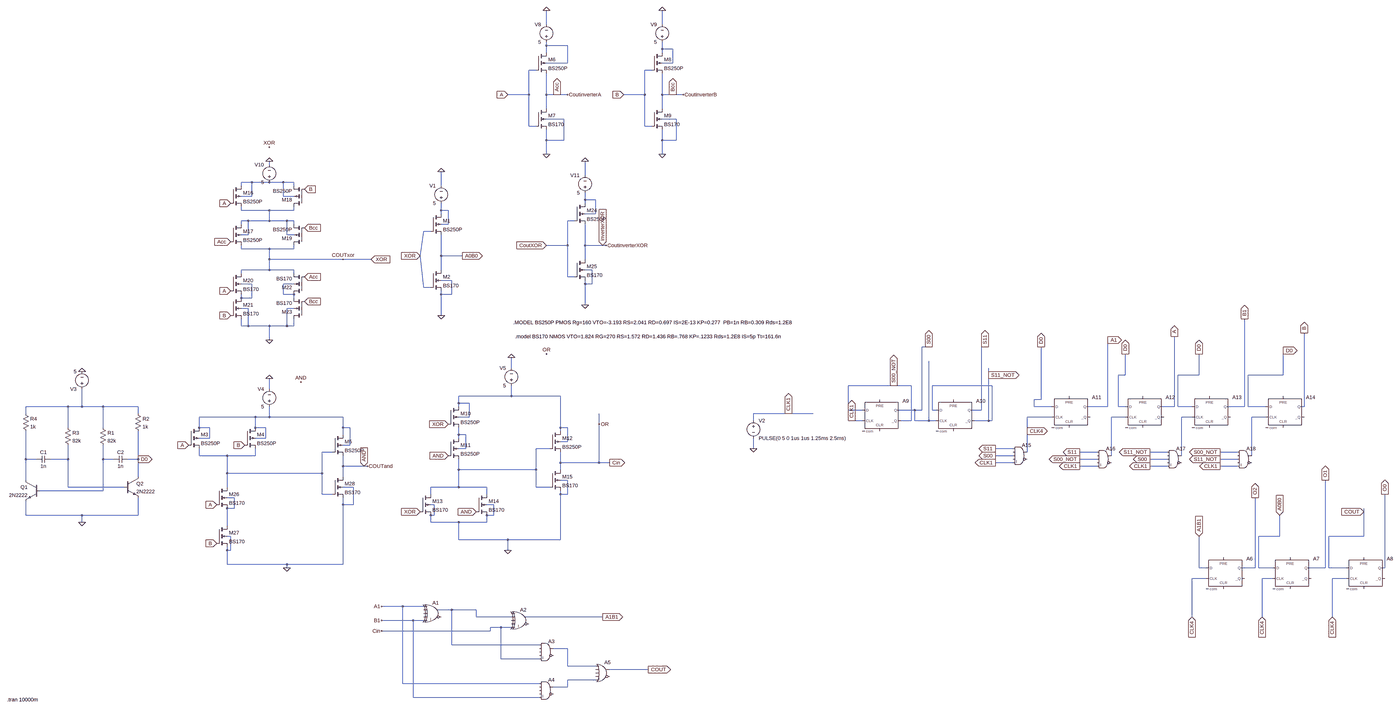
[diagram p0: schematic TASK_4.asc, whole sheet]
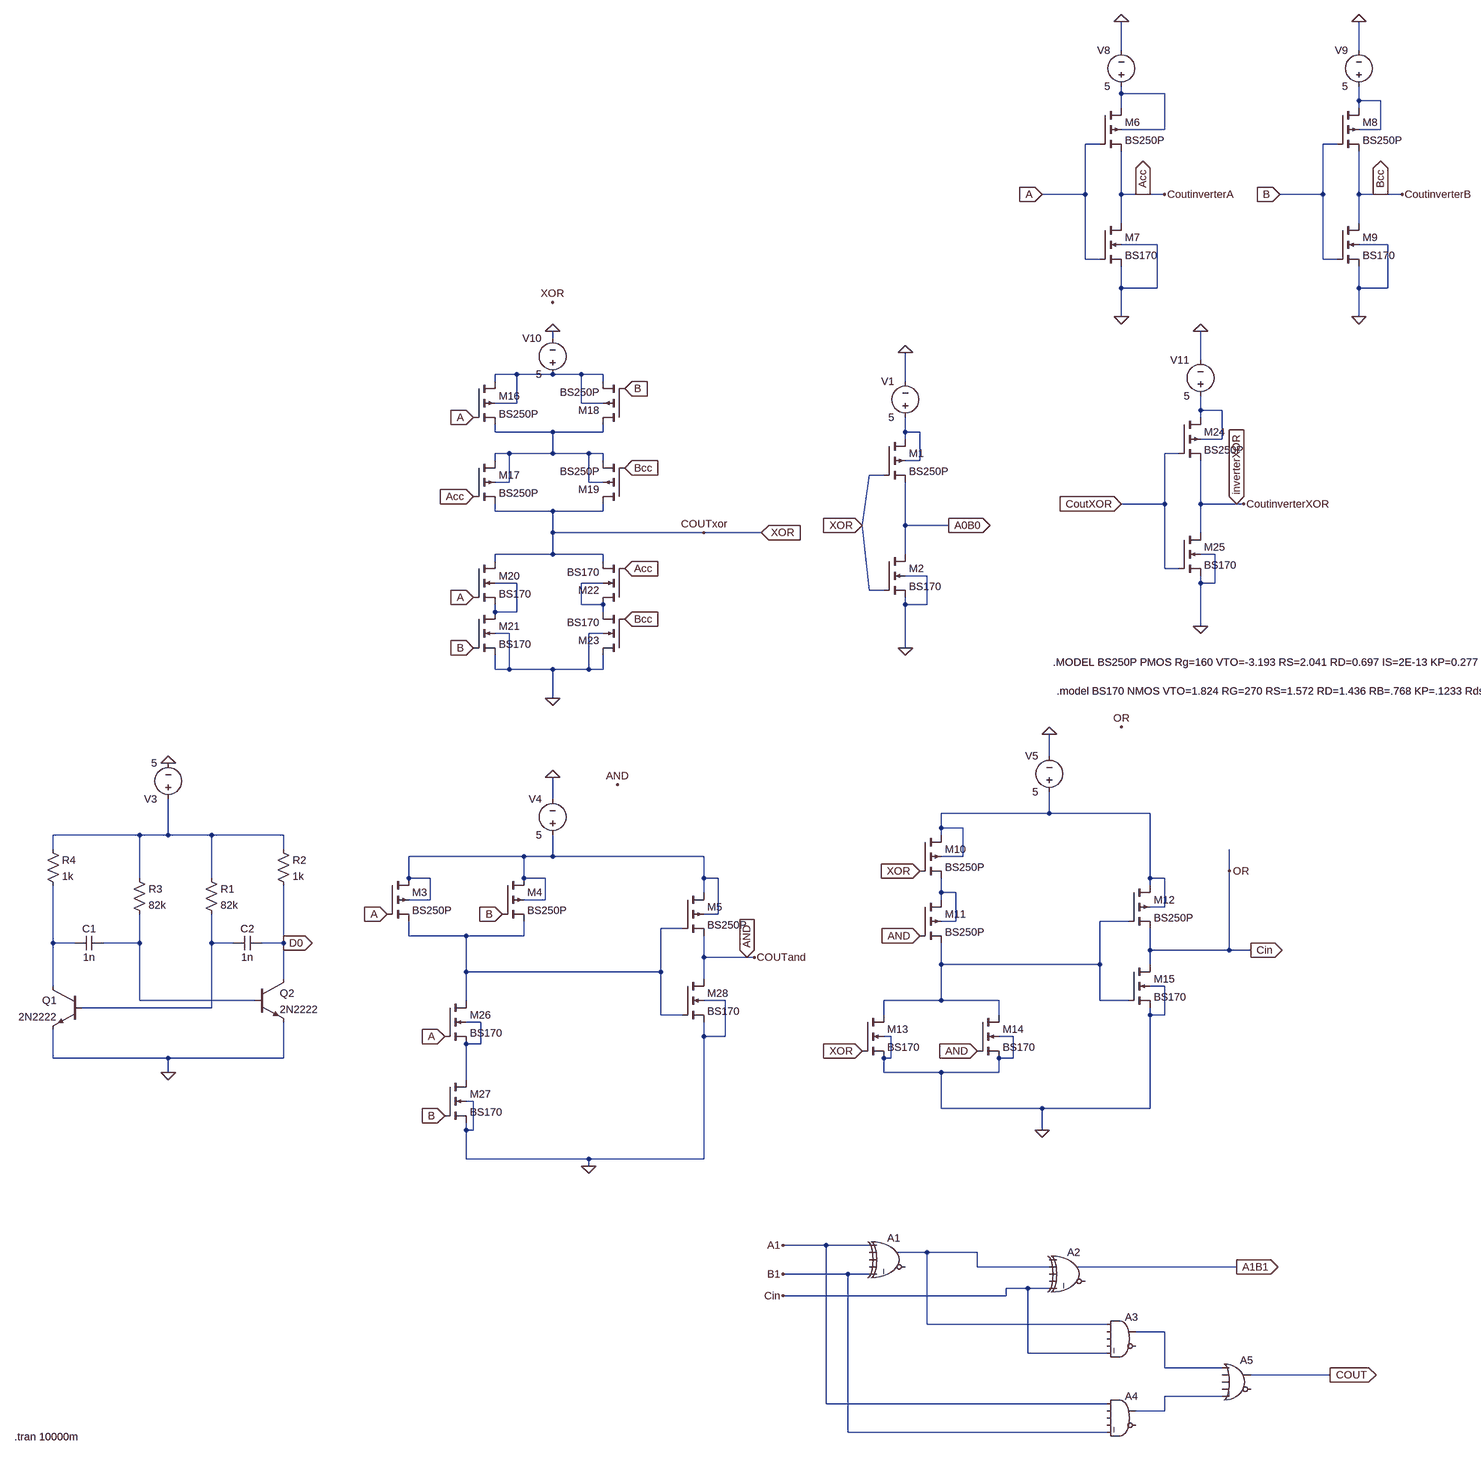
[diagram p1: schematic TASK_4.asc, part, row 1 of 1, column 1 of 2]
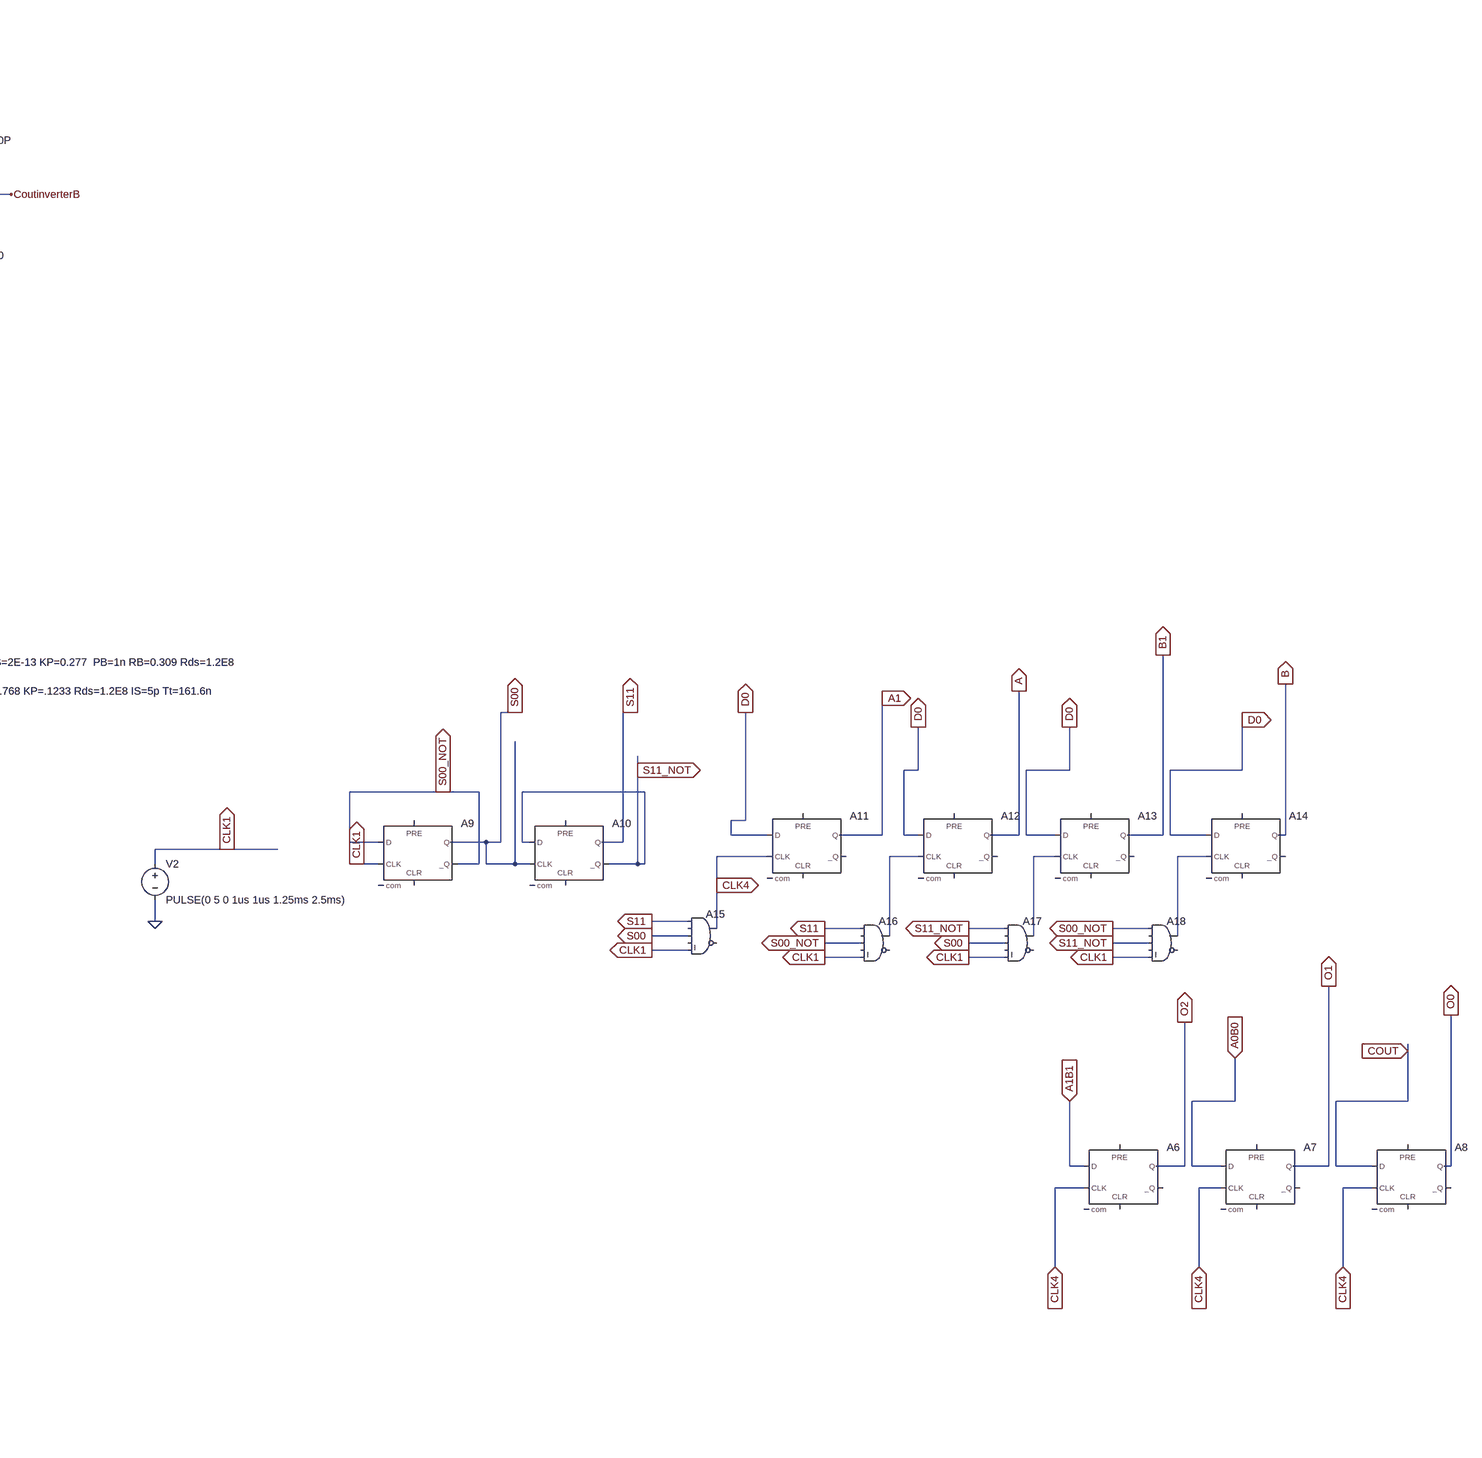
[diagram p2: schematic TASK_4.asc, part, row 1 of 1, column 2 of 2]
TASK_4.asc, the LTspice schematic file:
Version 4
SHEET 1 880 680
WIRE -4480 -4096 -4480 -4160
WIRE -3952 -4096 -3952 -4160
WIRE -4480 -4000 -4480 -4016
WIRE -4384 -4000 -4480 -4000
WIRE -3952 -3984 -3952 -4016
WIRE -3904 -3984 -3952 -3984
WIRE -4480 -3968 -4480 -4000
WIRE -3952 -3968 -3952 -3984
WIRE -4384 -3920 -4384 -4000
WIRE -4384 -3920 -4480 -3920
WIRE -3904 -3920 -3904 -3984
WIRE -3904 -3920 -3952 -3920
WIRE -4528 -3888 -4560 -3888
WIRE -4000 -3888 -4032 -3888
WIRE -4560 -3776 -4560 -3888
WIRE -4560 -3776 -4656 -3776
WIRE -4480 -3776 -4480 -3872
WIRE -4432 -3776 -4480 -3776
WIRE -4384 -3776 -4432 -3776
WIRE -4032 -3776 -4032 -3888
WIRE -4032 -3776 -4128 -3776
WIRE -3952 -3776 -3952 -3872
WIRE -3904 -3776 -3952 -3776
WIRE -3856 -3776 -3904 -3776
WIRE -4480 -3712 -4480 -3776
WIRE -3952 -3712 -3952 -3776
WIRE -4400 -3664 -4480 -3664
WIRE -3888 -3664 -3952 -3664
WIRE -4560 -3632 -4560 -3776
WIRE -4528 -3632 -4560 -3632
WIRE -4032 -3632 -4032 -3776
WIRE -4000 -3632 -4032 -3632
WIRE -4480 -3568 -4480 -3616
WIRE -4400 -3568 -4400 -3664
WIRE -4400 -3568 -4480 -3568
WIRE -3952 -3568 -3952 -3616
WIRE -3888 -3568 -3888 -3664
WIRE -3888 -3568 -3952 -3568
WIRE -4480 -3504 -4480 -3568
WIRE -3952 -3504 -3952 -3568
WIRE -5744 -3456 -5744 -3472
WIRE -4304 -3408 -4304 -3472
WIRE -5824 -3376 -5872 -3376
WIRE -5744 -3376 -5824 -3376
WIRE -5680 -3376 -5744 -3376
WIRE -5632 -3376 -5680 -3376
WIRE -5872 -3360 -5872 -3376
WIRE -5632 -3360 -5632 -3376
WIRE -4960 -3360 -4960 -3424
WIRE -5824 -3312 -5824 -3376
WIRE -5824 -3312 -5872 -3312
WIRE -5680 -3312 -5680 -3376
WIRE -5632 -3312 -5680 -3312
WIRE -4304 -3296 -4304 -3328
WIRE -4256 -3296 -4304 -3296
WIRE -4304 -3280 -4304 -3296
WIRE -5872 -3248 -5872 -3264
WIRE -5744 -3248 -5872 -3248
WIRE -5632 -3248 -5632 -3264
WIRE -5632 -3248 -5744 -3248
WIRE -4960 -3248 -4960 -3280
WIRE -4928 -3248 -4960 -3248
WIRE -4960 -3232 -4960 -3248
WIRE -4256 -3232 -4256 -3296
WIRE -4256 -3232 -4304 -3232
WIRE -5840 -3200 -5872 -3200
WIRE -5744 -3200 -5744 -3248
WIRE -5744 -3200 -5840 -3200
WIRE -5664 -3200 -5744 -3200
WIRE -5632 -3200 -5664 -3200
WIRE -4352 -3200 -4384 -3200
WIRE -5872 -3184 -5872 -3200
WIRE -5632 -3184 -5632 -3200
WIRE -4928 -3184 -4928 -3248
WIRE -4928 -3184 -4960 -3184
WIRE -5008 -3152 -5040 -3152
WIRE -5840 -3136 -5840 -3200
WIRE -5840 -3136 -5872 -3136
WIRE -5664 -3136 -5664 -3200
WIRE -5632 -3136 -5664 -3136
WIRE -4384 -3088 -4384 -3200
WIRE -4384 -3088 -4480 -3088
WIRE -4304 -3088 -4304 -3184
WIRE -4224 -3088 -4304 -3088
WIRE -4208 -3088 -4224 -3088
WIRE -5872 -3072 -5872 -3088
WIRE -5744 -3072 -5872 -3072
WIRE -5632 -3072 -5632 -3088
WIRE -5632 -3072 -5744 -3072
WIRE -5056 -3040 -5040 -3152
WIRE -4960 -3040 -4960 -3136
WIRE -4864 -3040 -4960 -3040
WIRE -5744 -3024 -5744 -3072
WIRE -5408 -3024 -5744 -3024
WIRE -5280 -3024 -5408 -3024
WIRE -4304 -3024 -4304 -3088
WIRE -5744 -2976 -5744 -3024
WIRE -5744 -2976 -5872 -2976
WIRE -5632 -2976 -5744 -2976
WIRE -4960 -2976 -4960 -3040
WIRE -4272 -2976 -4304 -2976
WIRE -5872 -2960 -5872 -2976
WIRE -5632 -2960 -5632 -2976
WIRE -4384 -2944 -4384 -3088
WIRE -4352 -2944 -4384 -2944
WIRE -4912 -2928 -4960 -2928
WIRE -5824 -2912 -5872 -2912
WIRE -5632 -2912 -5680 -2912
WIRE -4304 -2912 -4304 -2928
WIRE -4272 -2912 -4272 -2976
WIRE -4272 -2912 -4304 -2912
WIRE -5040 -2896 -5056 -3040
WIRE -5008 -2896 -5040 -2896
WIRE -5680 -2864 -5680 -2912
WIRE -5632 -2864 -5680 -2864
WIRE -4960 -2864 -4960 -2880
WIRE -4912 -2864 -4912 -2928
WIRE -4912 -2864 -4960 -2864
WIRE -5872 -2848 -5872 -2864
WIRE -5824 -2848 -5824 -2912
WIRE -5824 -2848 -5872 -2848
WIRE -5632 -2848 -5632 -2864
WIRE -4304 -2816 -4304 -2912
WIRE -5840 -2800 -5872 -2800
WIRE -5632 -2800 -5664 -2800
WIRE -4960 -2768 -4960 -2864
WIRE -5872 -2720 -5872 -2752
WIRE -5840 -2720 -5840 -2800
WIRE -5840 -2720 -5872 -2720
WIRE -5744 -2720 -5840 -2720
WIRE -5664 -2720 -5664 -2800
WIRE -5664 -2720 -5744 -2720
WIRE -5632 -2720 -5632 -2752
WIRE -5632 -2720 -5664 -2720
WIRE -5744 -2656 -5744 -2720
WIRE -1920 -2656 -1920 -2672
WIRE -2736 -2624 -2768 -2624
WIRE -2720 -2624 -2736 -2624
WIRE -2480 -2624 -2496 -2624
WIRE -2464 -2624 -2480 -2624
WIRE -1120 -2608 -1120 -2624
WIRE -4640 -2528 -4640 -2576
WIRE -2464 -2496 -2464 -2528
WIRE -1840 -2496 -1840 -2592
WIRE -1840 -2496 -1872 -2496
WIRE -1504 -2496 -1504 -2592
WIRE -1504 -2496 -1600 -2496
WIRE -1120 -2496 -1120 -2608
WIRE -1120 -2496 -1280 -2496
WIRE -2896 -2448 -3104 -2448
WIRE -2816 -2448 -2896 -2448
WIRE -2448 -2448 -2720 -2448
WIRE -5744 -2432 -5744 -2480
WIRE -4640 -2400 -4640 -2448
WIRE -4640 -2400 -4880 -2400
WIRE -4416 -2400 -4640 -2400
WIRE -2224 -2384 -2224 -2624
WIRE -2224 -2384 -2256 -2384
WIRE -4880 -2368 -4880 -2400
WIRE -4832 -2368 -4880 -2368
WIRE -6864 -2352 -7056 -2352
WIRE -6800 -2352 -6800 -2432
WIRE -6800 -2352 -6864 -2352
WIRE -6704 -2352 -6800 -2352
WIRE -6544 -2352 -6704 -2352
WIRE -4880 -2352 -4880 -2368
WIRE -2256 -2352 -2256 -2384
WIRE -2176 -2352 -2256 -2352
WIRE -1920 -2352 -1920 -2656
WIRE -1920 -2352 -2016 -2352
WIRE -1872 -2352 -1872 -2496
WIRE -1840 -2352 -1872 -2352
WIRE -1616 -2352 -1616 -2672
WIRE -1616 -2352 -1680 -2352
WIRE -1600 -2352 -1600 -2496
WIRE -1536 -2352 -1600 -2352
WIRE -1296 -2352 -1296 -2752
WIRE -1296 -2352 -1376 -2352
WIRE -1280 -2352 -1280 -2496
WIRE -1200 -2352 -1280 -2352
WIRE -1024 -2352 -1024 -2688
WIRE -1024 -2352 -1040 -2352
WIRE -3104 -2336 -3104 -2448
WIRE -3040 -2336 -3104 -2336
WIRE -2800 -2336 -2880 -2336
WIRE -2768 -2336 -2768 -2624
WIRE -2768 -2336 -2800 -2336
WIRE -2720 -2336 -2720 -2448
WIRE -2704 -2336 -2720 -2336
WIRE -2496 -2336 -2496 -2624
WIRE -2496 -2336 -2544 -2336
WIRE -7056 -2320 -7056 -2352
WIRE -6544 -2320 -6544 -2352
WIRE -3376 -2320 -3536 -2320
WIRE -3264 -2320 -3376 -2320
WIRE -5808 -2304 -6064 -2304
WIRE -5744 -2304 -5744 -2352
WIRE -5744 -2304 -5808 -2304
WIRE -5408 -2304 -5744 -2304
WIRE -4832 -2304 -4832 -2368
WIRE -4832 -2304 -4880 -2304
WIRE -2176 -2304 -2288 -2304
WIRE -1840 -2304 -1904 -2304
WIRE -1536 -2304 -1584 -2304
WIRE -1200 -2304 -1264 -2304
WIRE -3536 -2288 -3536 -2320
WIRE -3088 -2288 -3104 -2288
WIRE -3040 -2288 -3088 -2288
WIRE -2816 -2288 -2816 -2448
WIRE -2816 -2288 -2864 -2288
WIRE -2800 -2288 -2800 -2336
WIRE -2736 -2288 -2736 -2560
WIRE -2736 -2288 -2800 -2288
WIRE -2704 -2288 -2736 -2288
WIRE -2464 -2288 -2464 -2496
WIRE -2464 -2288 -2528 -2288
WIRE -2448 -2288 -2448 -2448
WIRE -2448 -2288 -2464 -2288
WIRE -4240 -2272 -4240 -2320
WIRE -6864 -2256 -6864 -2352
WIRE -6704 -2256 -6704 -2352
WIRE -6064 -2256 -6064 -2304
WIRE -6016 -2256 -6064 -2256
WIRE -5808 -2256 -5808 -2304
WIRE -5760 -2256 -5808 -2256
WIRE -5408 -2256 -5408 -2304
WIRE -5376 -2256 -5408 -2256
WIRE -4416 -2256 -4416 -2400
WIRE -4384 -2256 -4416 -2256
WIRE -4416 -2240 -4416 -2256
WIRE -2288 -2240 -2288 -2304
WIRE -5408 -2224 -5408 -2256
WIRE -4880 -2224 -4880 -2256
WIRE -4848 -2224 -4880 -2224
WIRE -6016 -2208 -6016 -2256
WIRE -6016 -2208 -6064 -2208
WIRE -5760 -2208 -5760 -2256
WIRE -5760 -2208 -5808 -2208
WIRE -4880 -2208 -4880 -2224
WIRE -4384 -2192 -4384 -2256
WIRE -4384 -2192 -4416 -2192
WIRE -5376 -2176 -5376 -2256
WIRE -5376 -2176 -5408 -2176
WIRE -4848 -2160 -4848 -2224
WIRE -4848 -2160 -4880 -2160
WIRE -4464 -2160 -4528 -2160
WIRE -3536 -2160 -3536 -2208
WIRE -2352 -2160 -2432 -2160
WIRE -5456 -2144 -5504 -2144
WIRE -2288 -2144 -2288 -2240
WIRE -1968 -2144 -2048 -2144
WIRE -1648 -2144 -1728 -2144
WIRE -1328 -2144 -1408 -2144
WIRE -6064 -2128 -6064 -2160
WIRE -5936 -2128 -6064 -2128
WIRE -5808 -2128 -5808 -2160
WIRE -5808 -2128 -5936 -2128
WIRE -2352 -2128 -2432 -2128
WIRE -1904 -2128 -1904 -2304
WIRE -1584 -2128 -1584 -2304
WIRE -1264 -2128 -1264 -2304
WIRE -7056 -2112 -7056 -2240
WIRE -7008 -2112 -7056 -2112
WIRE -6864 -2112 -6864 -2176
WIRE -6864 -2112 -6944 -2112
WIRE -6704 -2112 -6704 -2176
WIRE -6656 -2112 -6704 -2112
WIRE -6544 -2112 -6544 -2240
WIRE -6544 -2112 -6592 -2112
WIRE -1968 -2112 -2048 -2112
WIRE -1648 -2112 -1728 -2112
WIRE -1328 -2112 -1408 -2112
WIRE -4416 -2096 -4416 -2144
WIRE -4240 -2096 -4240 -2272
WIRE -4240 -2096 -4416 -2096
WIRE -4192 -2096 -4240 -2096
WIRE -2352 -2096 -2432 -2096
WIRE -5408 -2080 -5408 -2128
WIRE -5312 -2080 -5408 -2080
WIRE -5296 -2080 -5312 -2080
WIRE -1968 -2080 -2048 -2080
WIRE -1648 -2080 -1728 -2080
WIRE -1328 -2080 -1408 -2080
WIRE -4880 -2064 -4880 -2112
WIRE -4528 -2064 -4528 -2160
WIRE -4528 -2064 -4880 -2064
WIRE -4416 -2064 -4416 -2096
WIRE -5936 -2048 -5936 -2128
WIRE -5504 -2048 -5504 -2144
WIRE -5504 -2048 -5936 -2048
WIRE -6544 -2032 -6544 -2112
WIRE -5408 -2032 -5408 -2080
WIRE -7056 -2016 -7056 -2112
WIRE -4384 -2016 -4416 -2016
WIRE -6864 -1984 -6864 -2112
WIRE -6608 -1984 -6864 -1984
WIRE -5936 -1984 -5936 -2048
WIRE -5360 -1984 -5408 -1984
WIRE -4880 -1984 -4880 -2064
WIRE -4880 -1984 -5008 -1984
WIRE -4752 -1984 -4880 -1984
WIRE -4528 -1984 -4528 -2064
WIRE -4464 -1984 -4528 -1984
WIRE -6704 -1968 -6704 -2112
WIRE -6704 -1968 -6992 -1968
WIRE -5504 -1952 -5504 -2048
WIRE -5456 -1952 -5504 -1952
WIRE -5008 -1952 -5008 -1984
WIRE -4752 -1952 -4752 -1984
WIRE -4416 -1952 -4416 -1968
WIRE -4384 -1952 -4384 -2016
WIRE -4384 -1952 -4416 -1952
WIRE -5904 -1936 -5936 -1936
WIRE -5408 -1904 -5408 -1936
WIRE -5360 -1904 -5360 -1984
WIRE -5360 -1904 -5408 -1904
WIRE -4992 -1904 -5008 -1904
WIRE -4720 -1904 -4752 -1904
WIRE -5904 -1888 -5904 -1936
WIRE -5904 -1888 -5936 -1888
WIRE -752 -1872 -752 -1888
WIRE -7056 -1856 -7056 -1920
WIRE -6800 -1856 -7056 -1856
WIRE -6544 -1856 -6544 -1936
WIRE -6544 -1856 -6800 -1856
WIRE -4992 -1856 -4992 -1904
WIRE -4992 -1856 -5008 -1856
WIRE -4720 -1856 -4720 -1904
WIRE -4720 -1856 -4752 -1856
WIRE -6800 -1824 -6800 -1856
WIRE -5008 -1824 -5008 -1856
WIRE -4880 -1824 -5008 -1824
WIRE -4752 -1824 -4752 -1856
WIRE -4752 -1824 -4880 -1824
WIRE -5936 -1808 -5936 -1888
WIRE -5920 -1760 -5936 -1760
WIRE -1136 -1760 -1136 -1856
WIRE -1136 -1760 -1232 -1760
WIRE -752 -1760 -752 -1872
WIRE -752 -1760 -912 -1760
WIRE -4880 -1744 -4880 -1824
WIRE -4656 -1744 -4880 -1744
WIRE -4416 -1744 -4416 -1952
WIRE -4416 -1744 -4656 -1744
WIRE -5936 -1696 -5936 -1712
WIRE -5920 -1696 -5920 -1760
WIRE -5920 -1696 -5936 -1696
WIRE -4656 -1696 -4656 -1744
WIRE -5936 -1632 -5936 -1696
WIRE -5664 -1632 -5936 -1632
WIRE -5408 -1632 -5408 -1904
WIRE -5408 -1632 -5664 -1632
WIRE -5664 -1616 -5664 -1632
WIRE -1504 -1616 -1504 -1760
WIRE -1472 -1616 -1504 -1616
WIRE -1248 -1616 -1248 -1936
WIRE -1248 -1616 -1312 -1616
WIRE -1232 -1616 -1232 -1760
WIRE -1168 -1616 -1232 -1616
WIRE -928 -1616 -928 -2016
WIRE -928 -1616 -1008 -1616
WIRE -912 -1616 -912 -1760
WIRE -832 -1616 -912 -1616
WIRE -656 -1616 -656 -1952
WIRE -656 -1616 -672 -1616
WIRE -1472 -1568 -1536 -1568
WIRE -1168 -1568 -1216 -1568
WIRE -832 -1568 -896 -1568
WIRE -5136 -1440 -5232 -1440
WIRE -5040 -1440 -5136 -1440
WIRE -4912 -1424 -4976 -1424
WIRE -4800 -1424 -4912 -1424
WIRE -4800 -1392 -4800 -1424
WIRE -4640 -1392 -4800 -1392
WIRE -4224 -1392 -4576 -1392
WIRE -1536 -1392 -1536 -1568
WIRE -1216 -1392 -1216 -1568
WIRE -896 -1392 -896 -1568
WIRE -5088 -1376 -5232 -1376
WIRE -5040 -1376 -5088 -1376
WIRE -4688 -1344 -4736 -1344
WIRE -4640 -1344 -4688 -1344
WIRE -4736 -1328 -4736 -1344
WIRE -4736 -1328 -5232 -1328
WIRE -4912 -1264 -4912 -1424
WIRE -4512 -1264 -4912 -1264
WIRE -4384 -1248 -4448 -1248
WIRE -4688 -1200 -4688 -1344
WIRE -4512 -1200 -4688 -1200
WIRE -4384 -1168 -4384 -1248
WIRE -4256 -1168 -4384 -1168
WIRE -4016 -1152 -4192 -1152
WIRE -4256 -1104 -4384 -1104
WIRE -5136 -1088 -5136 -1440
WIRE -4512 -1088 -5136 -1088
WIRE -4384 -1072 -4384 -1104
WIRE -4384 -1072 -4448 -1072
WIRE -5088 -1024 -5088 -1376
WIRE -4512 -1024 -5088 -1024
FLAG -3536 -2160 0
FLAG -3376 -2320 CLK1
IOPIN -3376 -2320 Out
FLAG -2736 -2624 S00
IOPIN -2736 -2624 Out
FLAG -2480 -2624 S11
IOPIN -2480 -2624 Out
FLAG -2224 -2624 D0
IOPIN -2224 -2624 Out
FLAG -1840 -2592 D0
IOPIN -1840 -2592 Out
FLAG -1504 -2592 D0
IOPIN -1504 -2592 Out
FLAG -1120 -2608 D0
IOPIN -1120 -2608 Out
FLAG -1920 -2656 A1
IOPIN -1920 -2656 Out
FLAG -1616 -2672 A
IOPIN -1616 -2672 Out
FLAG -1296 -2752 B1
IOPIN -1296 -2752 Out
FLAG -1024 -2688 B
IOPIN -1024 -2688 Out
FLAG -2432 -2160 S11
IOPIN -2432 -2160 Out
FLAG -2432 -2128 S00
IOPIN -2432 -2128 Out
FLAG -2432 -2096 CLK1
IOPIN -2432 -2096 Out
FLAG -2048 -2144 S11
IOPIN -2048 -2144 Out
FLAG -2048 -2080 CLK1
IOPIN -2048 -2080 Out
FLAG -1728 -2112 S00
IOPIN -1728 -2112 Out
FLAG -1728 -2080 CLK1
IOPIN -1728 -2080 Out
FLAG -1408 -2080 CLK1
IOPIN -1408 -2080 Out
FLAG -2048 -2112 S00_NOT
IOPIN -2048 -2112 Out
FLAG -1728 -2144 S11_NOT
IOPIN -1728 -2144 Out
FLAG -1408 -2144 S00_NOT
IOPIN -1408 -2144 Out
FLAG -1408 -2112 S11_NOT
IOPIN -1408 -2112 Out
FLAG -2464 -2496 S11_NOT
IOPIN -2464 -2496 Out
FLAG -2896 -2448 S00_NOT
IOPIN -2896 -2448 Out
FLAG -6800 -2512 0
FLAG -6800 -1824 0
FLAG -6544 -2112 D0
IOPIN -6544 -2112 Out
FLAG -3088 -2288 CLK1
IOPIN -3088 -2288 Out
FLAG -4960 -3424 0
FLAG -4960 -2768 0
FLAG -5664 -1616 0
FLAG -6112 -2176 A
IOPIN -6112 -2176 In
FLAG -5984 -1904 A
IOPIN -5984 -1904 In
FLAG -5856 -2176 B
IOPIN -5856 -2176 In
FLAG -5984 -1728 B
IOPIN -5984 -1728 In
FLAG -5744 -2480 0
FLAG -5296 -2080 COUTand
FLAG -5600 -2464 AND
FLAG -4656 -1696 0
FLAG -4640 -2576 0
FLAG -4192 -2096 Cin
IOPIN -4192 -2096 Out
FLAG -4480 -2592 OR
FLAG -4864 -3040 A0B0
IOPIN -4864 -3040 Out
FLAG -4480 -4160 0
FLAG -4480 -3504 0
FLAG -4656 -3776 A
IOPIN -4656 -3776 In
FLAG -4384 -3776 CoutinverterA
FLAG -3952 -4160 0
FLAG -3952 -3504 0
FLAG -4128 -3776 B
IOPIN -4128 -3776 In
FLAG -3856 -3776 CoutinverterB
FLAG -4432 -3776 Acc
IOPIN -4432 -3776 Out
FLAG -3904 -3776 Bcc
IOPIN -3904 -3776 Out
FLAG -5920 -3280 A
IOPIN -5920 -3280 In
FLAG -5920 -2880 A
IOPIN -5920 -2880 In
FLAG -5584 -3344 B
IOPIN -5584 -3344 In
FLAG -5920 -2768 B
IOPIN -5920 -2768 In
FLAG -5920 -3104 Acc
IOPIN -5920 -3104 In
FLAG -5584 -2944 Acc
IOPIN -5584 -2944 In
FLAG -5584 -3168 Bcc
IOPIN -5584 -3168 In
FLAG -5584 -2832 Bcc
IOPIN -5584 -2832 In
FLAG -5744 -3472 0
FLAG -5408 -3024 COUTxor
FLAG -5744 -3536 XOR
FLAG -5744 -2656 0
FLAG -4304 -3472 0
FLAG -4304 -2816 0
FLAG -4208 -3088 CoutinverterXOR
FLAG -5280 -3024 XOR
IOPIN -5280 -3024 In
FLAG -4480 -3088 CoutXOR
IOPIN -4480 -3088 In
FLAG -4224 -3088 inverterXOR
IOPIN -4224 -3088 In
FLAG -4928 -2272 XOR
IOPIN -4928 -2272 In
FLAG -5056 -1872 XOR
IOPIN -5056 -1872 In
FLAG -5312 -2080 AND
IOPIN -5312 -2080 In
FLAG -4928 -2128 AND
IOPIN -4928 -2128 In
FLAG -4800 -1872 AND
IOPIN -4800 -1872 In
FLAG -5056 -3040 XOR
IOPIN -5056 -3040 In
FLAG -4240 -2272 OR
FLAG -5232 -1440 A1
FLAG -5232 -1376 B1
FLAG -5232 -1328 Cin
FLAG -4016 -1152 COUT
IOPIN -4016 -1152 Out
FLAG -4224 -1392 A1B1
IOPIN -4224 -1392 Out
FLAG -1504 -1760 A1B1
IOPIN -1504 -1760 In
FLAG -2288 -2240 CLK4
IOPIN -2288 -2240 Out
FLAG -1536 -1392 CLK4
IOPIN -1536 -1392 In
FLAG -1136 -1856 A0B0
IOPIN -1136 -1856 In
FLAG -752 -1872 COUT
IOPIN -752 -1872 In
FLAG -1248 -1936 O2
IOPIN -1248 -1936 Out
FLAG -928 -2016 O1
IOPIN -928 -2016 Out
FLAG -656 -1952 O0
IOPIN -656 -1952 Out
FLAG -1216 -1392 CLK4
IOPIN -1216 -1392 In
FLAG -896 -1392 CLK4
IOPIN -896 -1392 In
SYMBOL voltage -3536 -2304 R0
WINDOW 123 0 0 Left 2
WINDOW 39 0 0 Left 2
SYMATTR InstName V2
SYMATTR Value PULSE(0 5 0 1us 1us 1.25ms 2.5ms)
SYMBOL Digital\\dflop -2960 -2384 R0
SYMATTR InstName A9
SYMBOL Digital\\dflop -2624 -2384 R0
SYMATTR InstName A10
SYMBOL Digital\\dflop -2096 -2400 R0
SYMATTR InstName A11
SYMBOL Digital\\dflop -1760 -2400 R0
SYMATTR InstName A12
SYMBOL Digital\\dflop -1456 -2400 R0
SYMATTR InstName A13
SYMBOL Digital\\dflop -1120 -2400 R0
SYMATTR InstName A14
SYMBOL Digital\\and -2320 -2192 R0
SYMATTR InstName A15
SYMBOL Digital\\and -1936 -2176 R0
SYMATTR InstName A16
SYMBOL Digital\\and -1616 -2176 R0
SYMATTR InstName A17
SYMBOL Digital\\and -1296 -2176 R0
SYMATTR InstName A18
SYMBOL res -6720 -2272 R0
SYMATTR InstName R1
SYMATTR Value 82k
SYMBOL res -6560 -2336 R0
SYMATTR InstName R2
SYMATTR Value 1k
SYMBOL res -6880 -2272 R0
SYMATTR InstName R3
SYMATTR Value 82k
SYMBOL res -7072 -2336 R0
SYMATTR InstName R4
SYMATTR Value 1k
SYMBOL cap -6944 -2128 R90
WINDOW 0 0 32 VBottom 2
WINDOW 3 32 32 VTop 2
SYMATTR InstName C1
SYMATTR Value 1n
SYMBOL cap -6592 -2128 R90
WINDOW 0 0 32 VBottom 2
WINDOW 3 32 32 VTop 2
SYMATTR InstName C2
SYMATTR Value 1n
SYMBOL npn -6992 -2016 M0
SYMATTR InstName Q1
SYMATTR Value 2N2222
SYMBOL npn -6608 -2032 R0
SYMATTR InstName Q2
SYMATTR Value 2N2222
SYMBOL voltage -6800 -2416 R180
WINDOW 123 0 0 Left 2
WINDOW 39 0 0 Left 2
SYMATTR InstName V3
SYMATTR Value 5
SYMBOL pmos4 -5008 -3232 R0
SYMATTR InstName M1
SYMATTR Value BS250P
SYMBOL nmos4 -5008 -2976 R0
SYMATTR InstName M2
SYMATTR Value BS170
SYMBOL voltage -4960 -3264 R180
WINDOW 0 24 96 Left 2
WINDOW 3 24 16 Left 2
WINDOW 123 0 0 Left 2
WINDOW 39 0 0 Left 2
SYMATTR InstName V1
SYMATTR Value 5
SYMBOL pmos4 -6112 -2256 R0
SYMATTR InstName M3
SYMATTR Value BS250P
SYMBOL pmos4 -5856 -2256 R0
SYMATTR InstName M4
SYMATTR Value BS250P
SYMBOL pmos4 -5456 -2224 R0
SYMATTR InstName M5
SYMATTR Value BS250P
SYMBOL voltage -5744 -2336 R180
WINDOW 0 24 96 Left 2
WINDOW 3 24 16 Left 2
WINDOW 123 0 0 Left 2
WINDOW 39 0 0 Left 2
SYMATTR InstName V4
SYMATTR Value 5
SYMBOL voltage -4640 -2432 R180
WINDOW 0 24 96 Left 2
WINDOW 3 24 16 Left 2
WINDOW 123 0 0 Left 2
WINDOW 39 0 0 Left 2
SYMATTR InstName V5
SYMATTR Value 5
SYMBOL pmos4 -4528 -3968 R0
SYMATTR InstName M6
SYMATTR Value BS250P
SYMBOL nmos4 -4528 -3712 R0
SYMATTR InstName M7
SYMATTR Value BS170
SYMBOL voltage -4480 -4000 R180
WINDOW 0 24 96 Left 2
WINDOW 3 24 16 Left 2
WINDOW 123 0 0 Left 2
WINDOW 39 0 0 Left 2
SYMATTR InstName V8
SYMATTR Value 5
SYMBOL pmos4 -4000 -3968 R0
SYMATTR InstName M8
SYMATTR Value BS250P
SYMBOL nmos4 -4000 -3712 R0
SYMATTR InstName M9
SYMATTR Value BS170
SYMBOL voltage -3952 -4000 R180
WINDOW 0 24 96 Left 2
WINDOW 3 24 16 Left 2
WINDOW 123 0 0 Left 2
WINDOW 39 0 0 Left 2
SYMATTR InstName V9
SYMATTR Value 5
SYMBOL pmos4 -4928 -2352 R0
SYMATTR InstName M10
SYMATTR Value BS250P
SYMBOL pmos4 -4928 -2208 R0
SYMATTR InstName M11
SYMATTR Value BS250P
SYMBOL pmos4 -4464 -2240 R0
SYMATTR InstName M12
SYMATTR Value BS250P
SYMBOL nmos4 -5056 -1952 R0
SYMATTR InstName M13
SYMATTR Value BS170
SYMBOL nmos4 -4800 -1952 R0
SYMATTR InstName M14
SYMATTR Value BS170
SYMBOL nmos4 -4464 -2064 R0
SYMATTR InstName M15
SYMATTR Value BS170
SYMBOL voltage -5744 -3360 R180
WINDOW 0 24 96 Left 2
WINDOW 3 24 16 Left 2
WINDOW 123 0 0 Left 2
WINDOW 39 0 0 Left 2
SYMATTR InstName V10
SYMATTR Value 5
SYMBOL pmos4 -5920 -3360 R0
SYMATTR InstName M16
SYMATTR Value BS250P
SYMBOL pmos4 -5920 -3184 R0
SYMATTR InstName M17
SYMATTR Value BS250P
SYMBOL pmos4 -5584 -3264 R180
SYMATTR InstName M18
SYMATTR Value BS250P
SYMBOL pmos4 -5584 -3088 R180
SYMATTR InstName M19
SYMATTR Value BS250P
SYMBOL nmos4 -5920 -2960 R0
SYMATTR InstName M20
SYMATTR Value BS170
SYMBOL nmos4 -5920 -2848 R0
SYMATTR InstName M21
SYMATTR Value BS170
SYMBOL nmos4 -5584 -2864 R180
SYMATTR InstName M22
SYMATTR Value BS170
SYMBOL nmos4 -5584 -2752 R180
SYMATTR InstName M23
SYMATTR Value BS170
SYMBOL pmos4 -4352 -3280 R0
SYMATTR InstName M24
SYMATTR Value BS250P
SYMBOL nmos4 -4352 -3024 R0
SYMATTR InstName M25
SYMATTR Value BS170
SYMBOL voltage -4304 -3312 R180
WINDOW 0 24 96 Left 2
WINDOW 3 24 16 Left 2
WINDOW 123 0 0 Left 2
WINDOW 39 0 0 Left 2
SYMATTR InstName V11
SYMATTR Value 5
SYMBOL nmos4 -5984 -1984 R0
SYMATTR InstName M26
SYMATTR Value BS170
SYMBOL nmos4 -5984 -1808 R0
SYMATTR InstName M27
SYMATTR Value BS170
SYMBOL nmos4 -5456 -2032 R0
SYMATTR InstName M28
SYMATTR Value BS170
SYMBOL Digital\\xor -4992 -1472 R0
SYMATTR InstName A1
SYMBOL Digital\\xor -4592 -1440 R0
SYMATTR InstName A2
SYMBOL Digital\\and -4480 -1296 R0
SYMATTR InstName A3
SYMBOL Digital\\and -4480 -1120 R0
SYMATTR InstName A4
SYMBOL Digital\\or -4224 -1200 R0
SYMATTR InstName A5
SYMBOL Digital\\dflop -1392 -1664 R0
SYMATTR InstName A6
SYMBOL Digital\\dflop -1088 -1664 R0
SYMATTR InstName A7
SYMBOL Digital\\dflop -752 -1664 R0
SYMATTR InstName A8
TEXT -4632 -2736 Left 2 !.MODEL BS250P PMOS Rg=160 VTO=-3.193 RS=2.041 RD=0.697 IS=2E-13 KP=0.277  PB=1n RB=0.309 Rds=1.2E8
TEXT -4624 -2672 Left 2 !.model BS170 NMOS VTO=1.824 RG=270 RS=1.572 RD=1.436 RB=.768 KP=.1233 Rds=1.2E8 IS=5p Tt=161.6n
TEXT -7142 -1014 Left 2 !.tran 10000m

The netlist it stands for:
* TASK_4.asc
V2 CLK1 0 PULSE(0 5 0 1us 1us 1.25ms 2.5ms)
A9 S00_NOT 0 CLK1 0 0 S00_NOT S00 0 DFLOP
A10 S11_NOT 0 S00 0 0 S11_NOT S11 0 DFLOP
A11 D0 0 CLK4 0 0 0 A1 0 DFLOP
A12 D0 0 N012 0 0 0 A 0 DFLOP
A13 D0 0 N013 0 0 0 B1 0 DFLOP
A14 D0 0 N014 0 0 0 B 0 DFLOP
A15 S11 0 S00 0 CLK1 0 CLK4 0 AND
A16 S11 0 S00_NOT 0 CLK1 0 N012 0 AND
A17 S11_NOT 0 S00 0 CLK1 0 N013 0 AND
A18 S00_NOT 0 S11_NOT 0 CLK1 0 N014 0 AND
R1 N010 N020 82k
R2 N010 D0 1k
R3 N010 N019 82k
R4 N010 N018 1k
C1 N019 N018 1n
C2 D0 N020 1n
Q1 N018 N020 0 0 2N2222
Q2 D0 N019 0 0 2N2222
V3 N010 0 5
M1 N006 XOR A0B0 N006 BS250P
M2 A0B0 XOR 0 0 BS170
V1 N006 0 5
M3 N011 A N017 N011 BS250P
M4 N011 B N017 N011 BS250P
M5 N011 N017 AND N011 BS250P
V4 N011 0 5
V5 N009 0 5
M6 N001 A Acc N001 BS250P
M7 Acc A 0 0 BS170
V8 N001 0 5
M8 N002 B Bcc N002 BS250P
M9 Bcc B 0 0 BS170
V9 N002 0 5
M10 N009 XOR N015 N009 BS250P
M11 N015 AND N016 N015 BS250P
M12 N009 N016 OR N009 BS250P
M13 N016 XOR 0 0 BS170
M14 N016 AND 0 0 BS170
M15 OR N016 0 0 BS170
V10 N003 0 5
M16 N003 A N005 N003 BS250P
M17 N005 Acc XOR N005 BS250P
M18 N005 B N003 N003 BS250P
M19 XOR Bcc N005 N005 BS250P
M20 XOR A N007 N007 BS170
M21 N007 B 0 0 BS170
M22 N008 Acc XOR N008 BS170
M23 0 Bcc N008 0 BS170
M24 N004 XOR inverterXOR N004 BS250P
M25 inverterXOR XOR 0 0 BS170
V11 N004 0 5
M26 N017 A N021 N021 BS170
M27 N021 B 0 0 BS170
M28 AND N017 0 0 BS170
A1 A1 0 0 0 B1 0 N022 0 XOR
A2 0 N022 0 0 OR 0 A1B1 0 XOR
A3 N022 0 0 0 OR 0 N023 0 AND
A4 A1 0 0 0 B1 0 N024 0 AND
A5 N023 0 0 0 N024 0 COUT 0 OR
A6 A1B1 0 CLK4 0 0 0 O2 0 DFLOP
A7 A0B0 0 CLK4 0 0 0 O1 0 DFLOP
A8 COUT 0 CLK4 0 0 0 O0 0 DFLOP
.model NPN NPN
.model PNP PNP
.lib standard.bjt
.model NMOS NMOS
.model PMOS PMOS
.lib standard.mos
.MODEL BS250P PMOS Rg=160 VTO=-3.193 RS=2.041 RD=0.697 IS=2E-13 KP=0.277  PB=1n RB=0.309 Rds=1.2E8
.model BS170 NMOS VTO=1.824 RG=270 RS=1.572 RD=1.436 RB=.768 KP=.1233 Rds=1.2E8 IS=5p Tt=161.6n
.tran 10000m
.backanno
.end